# Altium schematic sheet Top Level.SchDoc
size A4
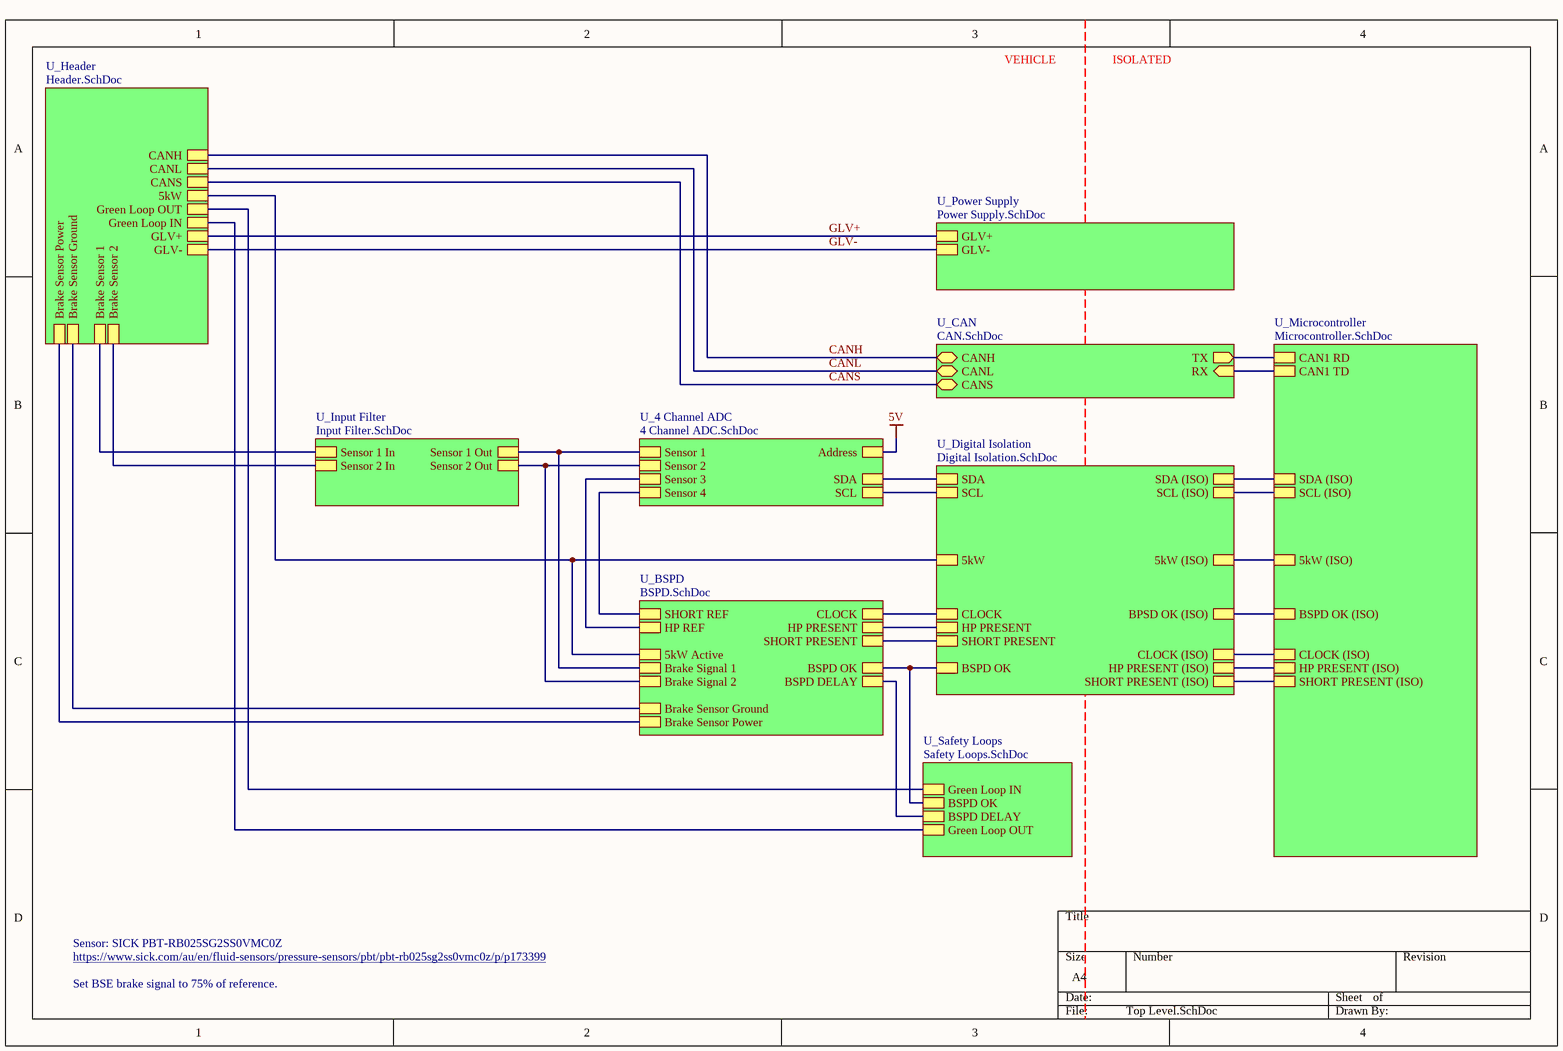
[diagram p0: Top Level.SchDoc]

## Sub-sheets
U_4 Channel ADC = 4 Channel ADC.SchDoc: Address, SCL, SDA, Sensor 1, Sensor 2, Sensor 3, Sensor 4
U_BSPD = BSPD.SchDoc: BSPD OK, HP PRESENT, SHORT PRESENT, CLOCK, HP REF, SHORT REF, 5kW Active, Brake Signal 1, Brake Signal 2, BSPD DELAY, Brake Sensor Ground, Brake Sensor Power
U_CAN = CAN.SchDoc: CANS (bidir), RX (in), CANL (bidir), CANH (bidir), TX (out)
U_Digital Isolation = Digital Isolation.SchDoc: SDA (ISO), SCL (ISO), SDA, SCL, CLOCK (ISO), HP PRESENT (ISO), SHORT PRESENT (ISO), BPSD OK (ISO), 5kW, 5kW (ISO), BSPD OK, HP PRESENT, SHORT PRESENT, CLOCK
U_Header = Header.SchDoc: Brake Sensor 2, Brake Sensor 1, CANS, CANH, CANL, GLV+, GLV-, Green Loop IN, Green Loop OUT, 5kW, Brake Sensor Power, Brake Sensor Ground
U_Input Filter = Input Filter.SchDoc: Sensor 1 In, Sensor 1 Out, Sensor 2 In, Sensor 2 Out
U_Microcontroller = Microcontroller.SchDoc: BSPD OK (ISO), 5kW (ISO), CLOCK (ISO), HP PRESENT (ISO), SHORT PRESENT (ISO), SDA (ISO), SCL (ISO), CAN1 RD, CAN1 TD
U_Power Supply = Power Supply.SchDoc: GLV+, GLV-
U_Safety Loops = Safety Loops.SchDoc: Green Loop OUT, Green Loop IN, BSPD OK, BSPD DELAY

## Nets
5V: sheet U_4 Channel ADC/Address
CANH: sheet U_CAN/CANH, sheet U_Header/CANH
CANL: sheet U_CAN/CANL, sheet U_Header/CANL
CANS: sheet U_CAN/CANS, sheet U_Header/CANS
GLV+: sheet U_Power Supply/GLV+, sheet U_Header/GLV+
GLV-: sheet U_Power Supply/GLV-, sheet U_Header/GLV-
(unnamed): sheet U_BSPD/BSPD OK, sheet U_Digital Isolation/BSPD OK, sheet U_Safety Loops/BSPD OK
(unnamed): sheet U_BSPD/HP PRESENT, sheet U_Digital Isolation/HP PRESENT
(unnamed): sheet U_BSPD/SHORT PRESENT, sheet U_Digital Isolation/SHORT PRESENT
(unnamed): sheet U_BSPD/CLOCK, sheet U_Digital Isolation/CLOCK
(unnamed): sheet U_BSPD/HP REF, sheet U_4 Channel ADC/Sensor 3
(unnamed): sheet U_BSPD/SHORT REF, sheet U_4 Channel ADC/Sensor 4
(unnamed): sheet U_BSPD/5kW Active, sheet U_Digital Isolation/5kW, sheet U_Header/5kW
(unnamed): sheet U_BSPD/Brake Signal 1, sheet U_4 Channel ADC/Sensor 1, sheet U_Input Filter/Sensor 1 Out
(unnamed): sheet U_BSPD/Brake Signal 2, sheet U_4 Channel ADC/Sensor 2, sheet U_Input Filter/Sensor 2 Out
(unnamed): sheet U_BSPD/BSPD DELAY, sheet U_Safety Loops/BSPD DELAY
(unnamed): sheet U_BSPD/Brake Sensor Ground, sheet U_Header/Brake Sensor Ground
(unnamed): sheet U_BSPD/Brake Sensor Power, sheet U_Header/Brake Sensor Power
(unnamed): sheet U_4 Channel ADC/SCL, sheet U_Digital Isolation/SCL
(unnamed): sheet U_4 Channel ADC/SDA, sheet U_Digital Isolation/SDA
(unnamed): sheet U_Input Filter/Sensor 1 In, sheet U_Header/Brake Sensor 1
(unnamed): sheet U_Input Filter/Sensor 2 In, sheet U_Header/Brake Sensor 2
(unnamed): sheet U_Digital Isolation/SDA (ISO), sheet U_Microcontroller/SDA (ISO)
(unnamed): sheet U_Digital Isolation/SCL (ISO), sheet U_Microcontroller/SCL (ISO)
(unnamed): sheet U_Digital Isolation/CLOCK (ISO), sheet U_Microcontroller/CLOCK (ISO)
(unnamed): sheet U_Digital Isolation/HP PRESENT (ISO), sheet U_Microcontroller/HP PRESENT (ISO)
(unnamed): sheet U_Digital Isolation/SHORT PRESENT (ISO), sheet U_Microcontroller/SHORT PRESENT (ISO)
(unnamed): sheet U_Digital Isolation/BPSD OK (ISO), sheet U_Microcontroller/BSPD OK (ISO)
(unnamed): sheet U_Digital Isolation/5kW (ISO), sheet U_Microcontroller/5kW (ISO)
(unnamed): sheet U_Microcontroller/CAN1 RD, sheet U_CAN/TX
(unnamed): sheet U_Microcontroller/CAN1 TD, sheet U_CAN/RX
(unnamed): sheet U_Safety Loops/Green Loop OUT, sheet U_Header/Green Loop IN
(unnamed): sheet U_Safety Loops/Green Loop IN, sheet U_Header/Green Loop OUT

## Notes on the sheet
- VEHICLE
- ISOLATED
- Sensor: SICK PBT-RB025SG2SS0VMC0Z
- https://www.sick.com/au/en/fluid-sensors/pressure-sensors/pbt/pbt-rb025sg2ss0vmc0z/p/p173399
- Set BSE brake signal to 75% of reference.